# Altium schematic sheet main.SCHDOC
size A
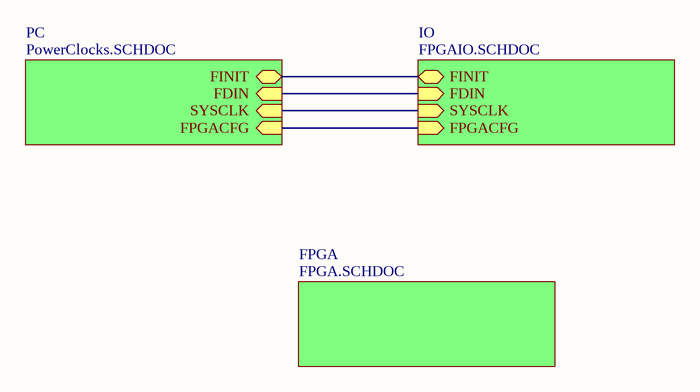
[diagram p0: main.SCHDOC]

## Sub-sheets
FPGA = FPGA.SCHDOC: no entries
IO = FPGAIO.SCHDOC: FPGACFG (in), SYSCLK (in), FINIT (bidir), FDIN (in)
PC = PowerClocks.SCHDOC: FINIT (bidir), FDIN (in), SYSCLK (in), FPGACFG (in)

## Nets
(unnamed): sheet PC/FINIT, sheet IO/FINIT
(unnamed): sheet PC/FDIN, sheet IO/FDIN
(unnamed): sheet PC/SYSCLK, sheet IO/SYSCLK
(unnamed): sheet PC/FPGACFG, sheet IO/FPGACFG